# Altium schematic sheet ads1120adcModule.SchDoc: ADS1120 ADC Module
size A; Author: J. Sullivan; DrawnBy: J. Sullivan; Organization: ORGANIZATION; Address1: ADDRESS 1; Address2: ADDRESS 2; Address3: ADDRESS 3; Address4: ADDRESS 4; Revision: -; SheetNumber: 8; SheetTotal: 13; ENG_APP_DATE: 10/15/22; DSN_APP_DATE: --/--/--; CHK_APP_DATE: --/--/--
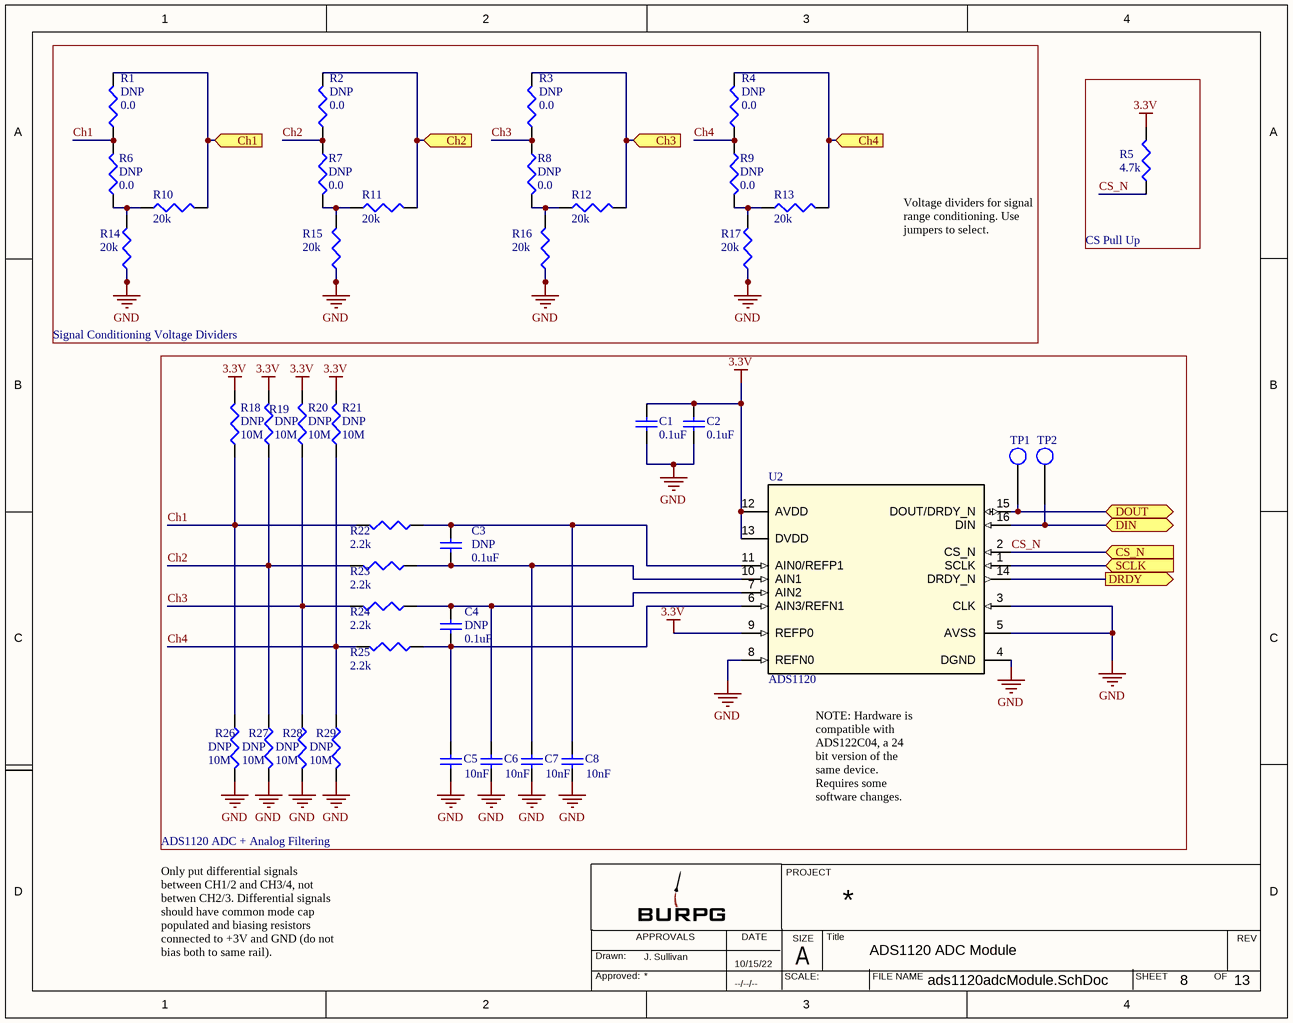
[diagram p0: ads1120adcModule.SchDoc]

## Parts
C1  value 0.1uF  [1608[0603]]  (hidden comment: Cap)
C2  value 0.1uF  [1608[0603]]  (hidden comment: Cap)
C3  DNP  value 0.1uF  [1608[0603]]
C4  DNP  value 0.1uF  [1608[0603]]
C5  value 10nF  [1608[0603]]  (hidden comment: Cap)
C6  value 10nF  [1608[0603]]  (hidden comment: Cap)
C7  value 10nF  [1608[0603]]  (hidden comment: Cap)
C8  value 10nF  [1608[0603]]  (hidden comment: Cap)
R1  DNP  value 0.0  [J1-0603]
R2  DNP  value 0.0  [J1-0603]
R3  DNP  value 0.0  [J1-0603]
R4  DNP  value 0.0  [J1-0603]
R5  value 4.7k  [J1-0603]  (hidden comment: Res3)
R6  DNP  value 0.0  [J1-0603]
R7  DNP  value 0.0  [J1-0603]
R8  DNP  value 0.0  [J1-0603]
R9  DNP  value 0.0  [J1-0603]
R10  value 20k  [J1-0603]  (hidden comment: Res3)
R11  value 20k  [J1-0603]  (hidden comment: Res3)
R12  value 20k  [J1-0603]  (hidden comment: Res3)
R13  value 20k  [J1-0603]  (hidden comment: Res3)
R14  value 20k  [J1-0603]  (hidden comment: Res3)
R15  value 20k  [J1-0603]  (hidden comment: Res3)
R16  value 20k  [J1-0603]  (hidden comment: Res3)
R17  value 20k  [J1-0603]  (hidden comment: Res3)
R18  DNP  value 10M  [J1-0603]
R19  DNP  value 10M  [J1-0603]
R20  DNP  value 10M  [J1-0603]
R21  DNP  value 10M  [J1-0603]
R22  value 2.2k  [J1-0603]  (hidden comment: 3)
R23  value 2.2k  [J1-0603]  (hidden comment: 3)
R24  value 2.2k  [J1-0603]  (hidden comment: 3)
R25  value 2.2k  [J1-0603]  (hidden comment: 3)
R26  DNP  value 10M  [J1-0603]
R27  DNP  value 10M  [J1-0603]
R28  DNP  value 10M  [J1-0603]
R29  DNP  value 10M  [J1-0603]
TP1  BURPG_TestPoint1  [BURPG_TestPoint1]  (value not drawn)  (no BOM)
TP2  BURPG_TestPoint1  [BURPG_TestPoint1]  (value not drawn)  (no BOM)
U2  ADS1120  [TSSOP-16]

## Blocks framed on the sheet
Signal Conditioning Voltage Dividers: R1-R4 R6-R17
CS Pull Up: R5
ADS1120 ADC + Analog Filtering: C1-C8 R18-R29 TP1 TP2 U2

## Ports
Ch1 (in), Ch2 (in), Ch3 (in), Ch4 (in), CS_N (in), DIN (bidir), DOUT (bidir), DRDY (out), SCLK (in)

## Nets
3.3V: C1.2 C2.2 R5.2 R18.2 R19.2 R20.2 R21.2 U2.9(REFP0) U2.12(AVDD) U2.13(DVDD)
GND: C1.1 C2.1 C5.1 C6.1 C7.1 C8.1 R14.1 R15.1 R16.1 R17.1 R26.2 R27.2 R28.2 R29.2 U2.3(CLK) U2.4(DGND) U2.5(AVSS) U2.8(REFN0)
Ch1: R1.2 R10.2 ; port Ch1
Ch1: R1.1 R6.2 R18.1 R22.2 R26.1  [a separate net that carries the same name]
Ch2: R2.1 R7.1 R19.1 R23.2 R27.1
Ch2: R2.2 R11.2 ; port Ch2  [a separate net that carries the same name]
Ch3: R3.1 R8.1 R20.1 R24.2 R28.1
Ch3: R3.2 R12.2 ; port Ch3  [a separate net that carries the same name]
Ch4: R4.1 R9.1 R21.1 R25.2 R29.1
Ch4: R4.2 R13.2 ; port Ch4  [a separate net that carries the same name]
CS_N: R5.1 U2.2(CS_N) ; port CS_N
DIN: TP2.1 U2.16(DIN) ; port DIN
DOUT: TP1.1 U2.15(DOUT/DRDY_N) ; port DOUT
DRDY: U2.14(DRDY_N) ; port DRDY
SCLK: U2.1(SCLK) ; port SCLK
NetC3_1: C3.1 C8.2 R22.1 U2.11(AIN0/REFP1)
NetC3_2: C3.2 C7.2 R23.1 U2.10(AIN1)
NetC4_1: C4.1 C6.2 R24.1 U2.7(AIN2)
NetC4_2: C4.2 C5.2 R25.1 U2.6(AIN3/REFN1)
NetR6_1: R6.1 R10.1 R14.2
NetR7_2: R7.2 R11.1 R15.2
NetR8_2: R8.2 R12.1 R16.2
NetR9_2: R9.2 R13.1 R17.2

## Notes on the sheet
- Voltage dividers for signal range conditioning. Use jumpers to select.
- (near U2) NOTE: Hardware is compatible with ADS122C04, a 24 bit version of the same device. Requires some software changes.
- Only put differential signals between CH1/2 and CH3/4, not betwen CH2/3. Differential signals should have common mode cap populated and biasing resistors connected to +3V and GND (do not bias both to same rail).
- PROJECT
- Drawn:
- Approved:
- APPROVALS
- DATE
- SCALE:
- SIZE
- A
- Title
- FILE NAME
- SHEET
- OF
- REV

## Library data of the parts
C1-C8 = Cap: Capacitor; Published: 8-Jun-2000; LatestRevisionDate: 17-Jul-2002; LatestRevisionNote: Re-released for DXP Platform.; PackageReference: RAD-0.3; Publisher: Altium Limited; PackageDescription: Radial Cap, Thru-Hole; 2 Leads; 0.3 in Pin Spacing
R1-R17 R22-R25 = Res3: Resistor; Published: 8-Jun-2000; LatestRevisionDate: 29-May-2009; LatestRevisionNote: IPC-7351 Footprint Added.; PackageReference: J1-0603; Publisher: Altium Limited; PackageDescription: Chip Resistor
R18-R21 R26-R29 = Res3: Resistor Bias; Published: 8-Jun-2000; LatestRevisionDate: 29-May-2009; LatestRevisionNote: IPC-7351 Footprint Added.; PackageReference: J1-0603; Publisher: Altium Limited; PackageDescription: Chip Resistor
U2 = BUPRG_ADS1120: Texas Instruments ADS1120 SPI 4Ch 2kHz 16 bit delta-sigma; Manufacturer_Part_Number: ADS112C04IPW; Type: DEV; RefDes: RefDes; Copyright: Copyright (C) 2022 Ultra Librarian. All rights reserved.; Mfr_Name: Texas Instruments